# Altium schematic sheet 08 USB OTG & POWER.SchDoc
size A3; SPICEModelCacheUQTFMMXK: <root> / <DocumentId>UQTFMMXK</DocumentId> / </root>
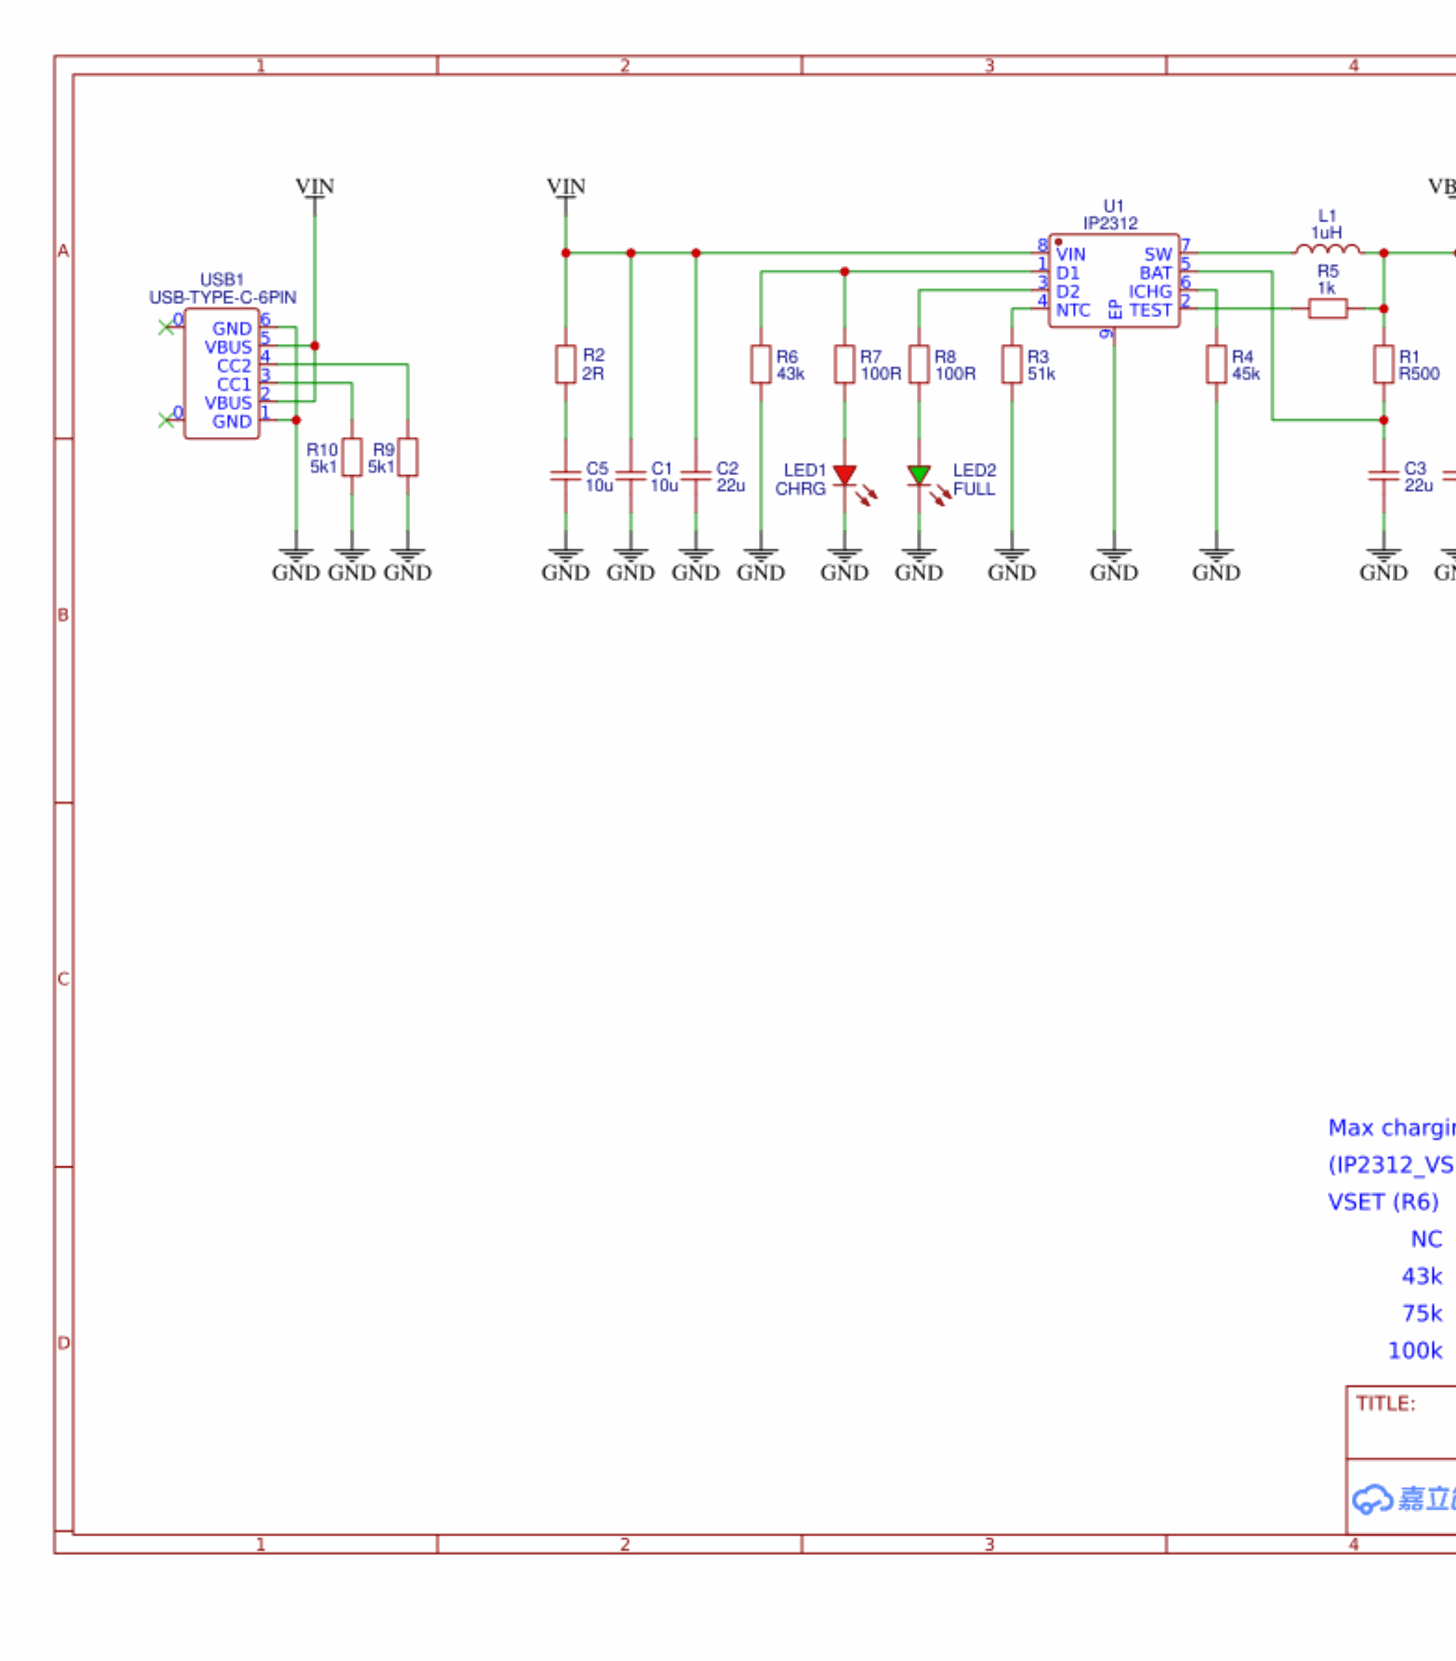
[diagram p0: 08 USB OTG & POWER.SchDoc, left]
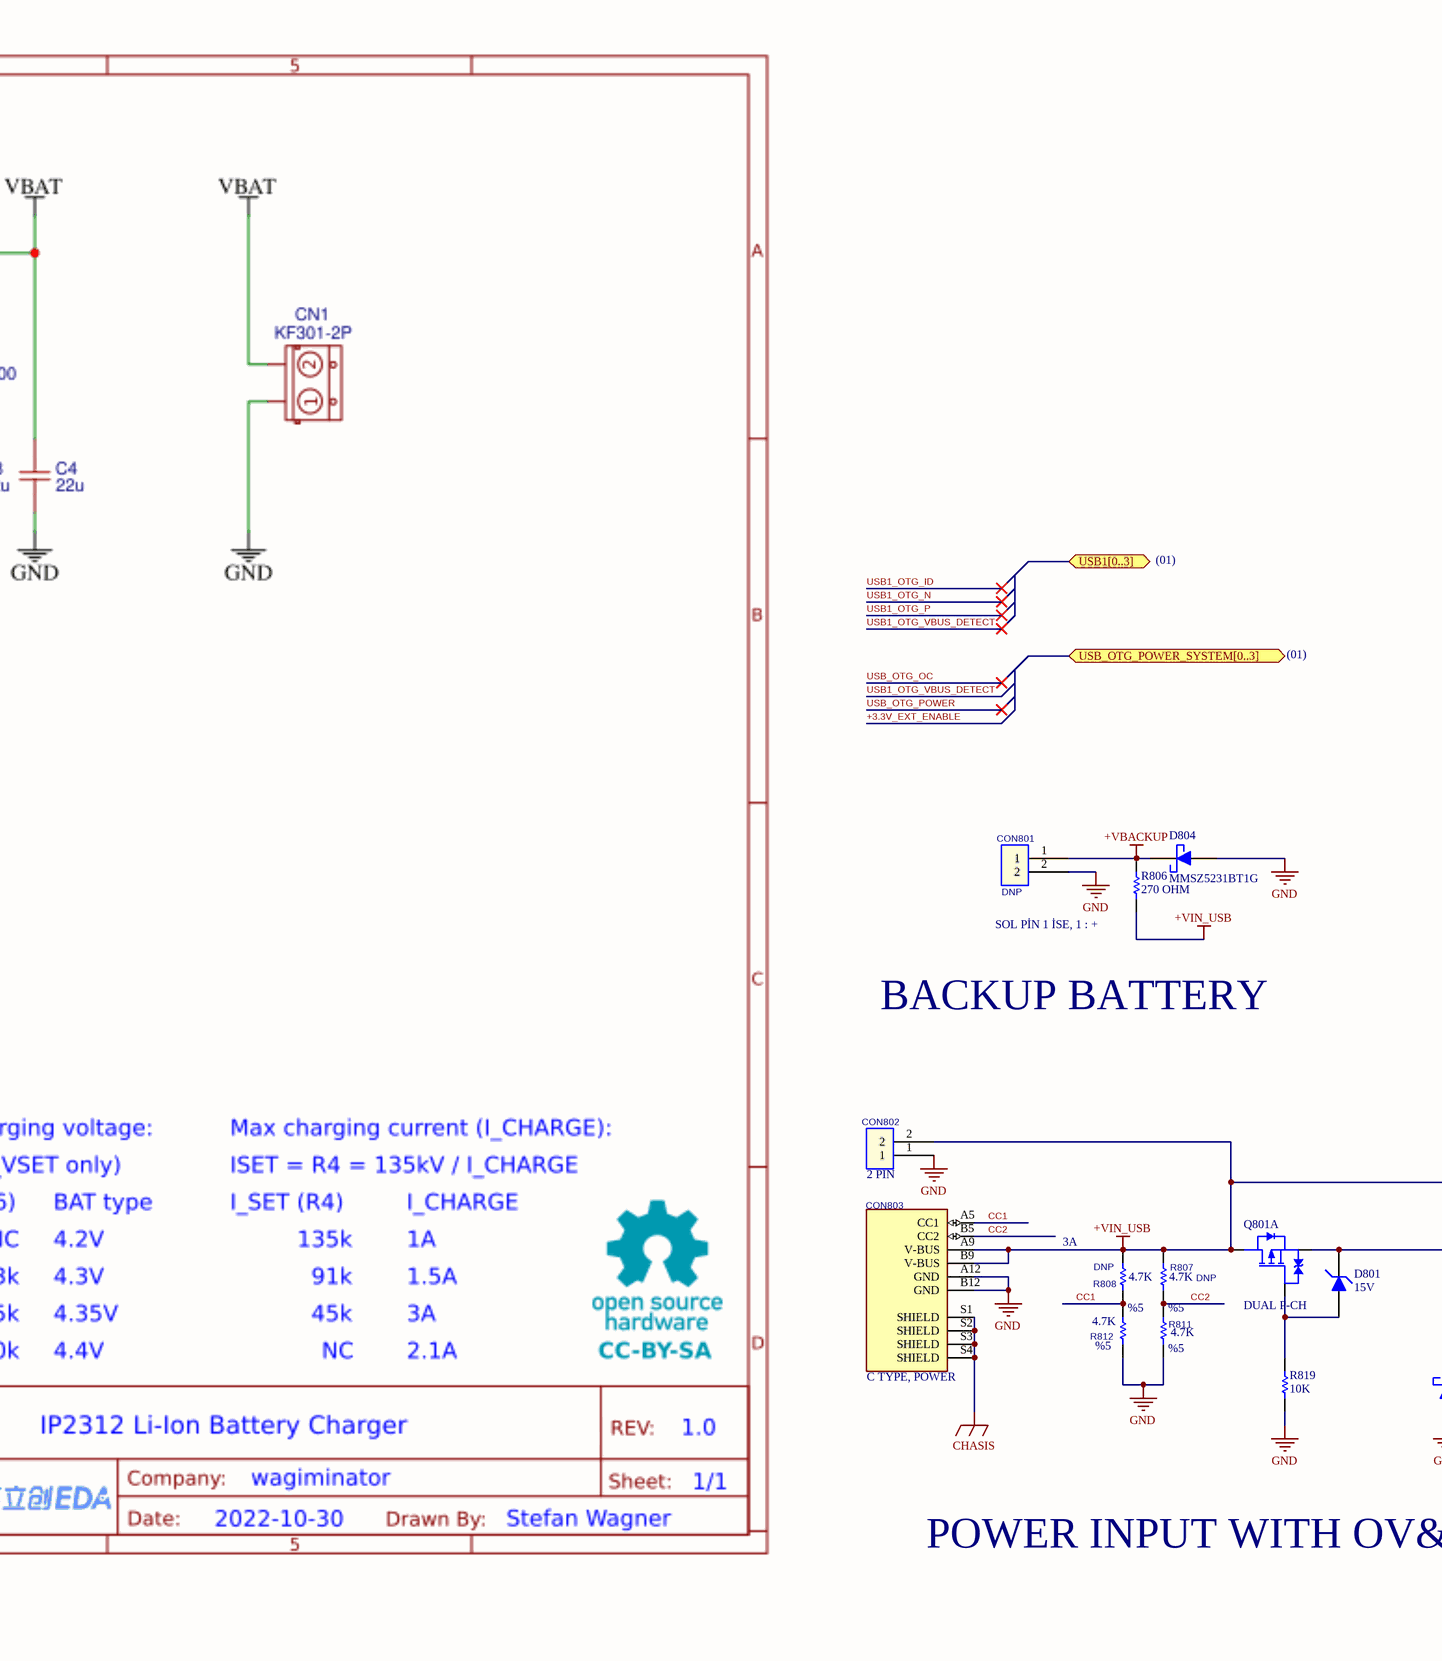
[diagram p1: 08 USB OTG & POWER.SchDoc, middle]
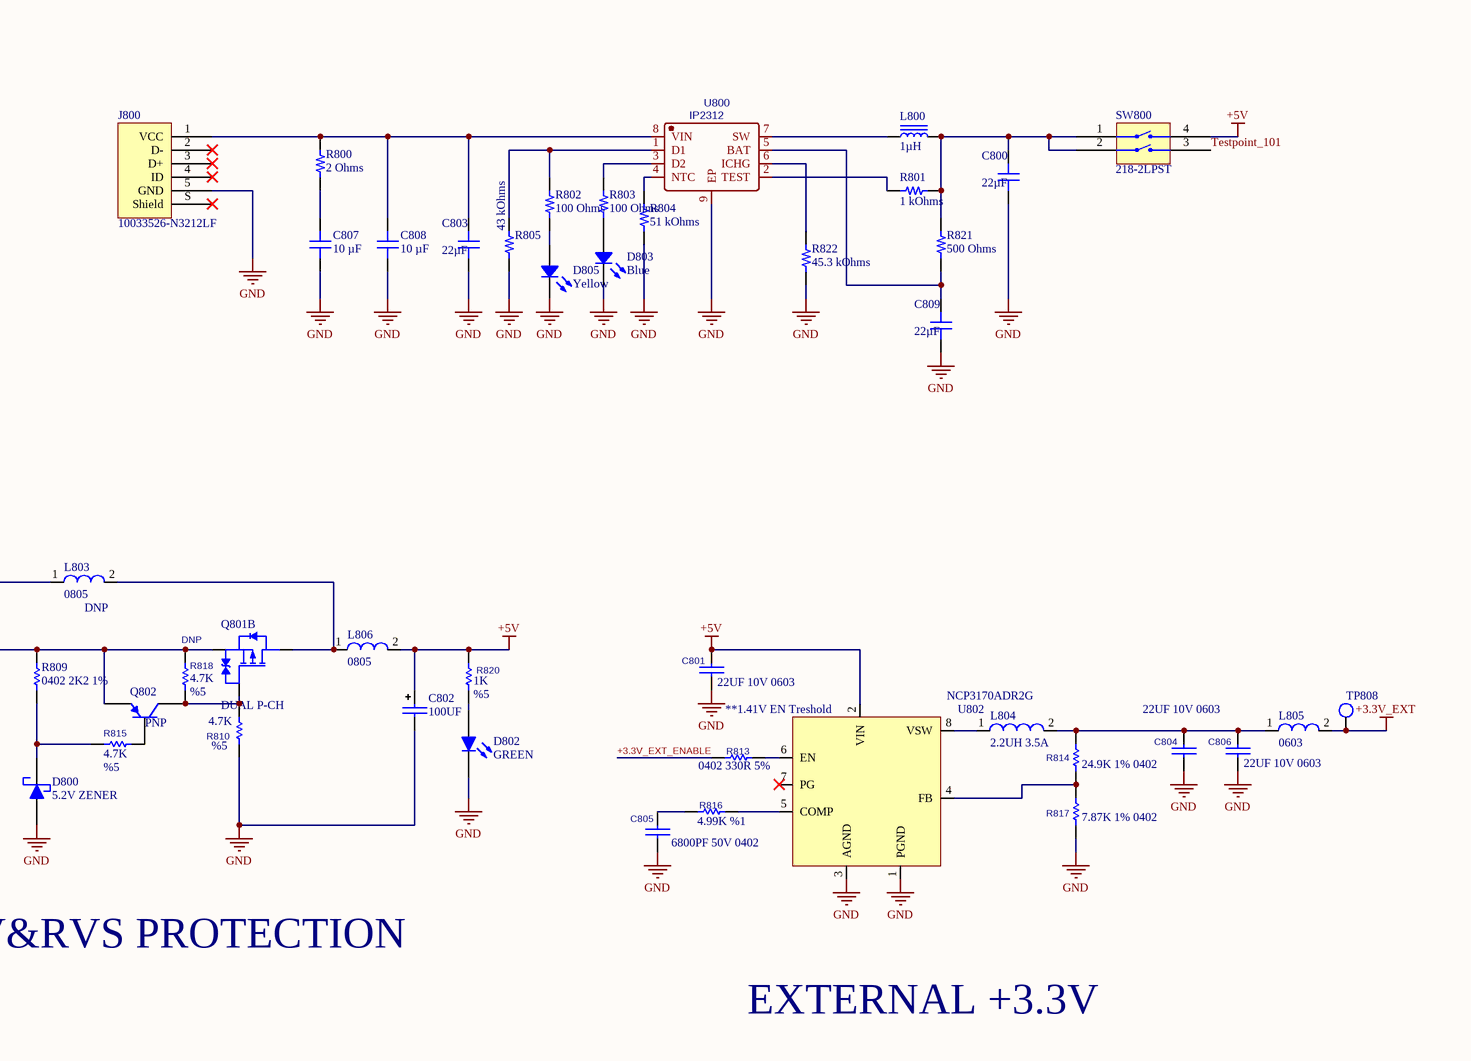
[diagram p2: 08 USB OTG & POWER.SchDoc, right]

## Parts
C800  22µF  [CAP 0603_1608]
C801  22UF 10V 0603  [0603_CC]
C802  100UF  [UWR1A101MCL1GB]
C803  22µF  [CAP 0603_1608]
C804  22UF 10V 0603  [0603_CC]
C805  6800PF 50V 0402  [0402_CC]
C806  22UF 10V 0603  [0603_CC]
C807  10 µF  [CAP 0603_1608]
C808  10 µF  [CAP 0603_1608]
C809  22µF  [CAP 0603_1608]
CON801  ASSY_OPT: DNP  [B2B-PH-K-S]  (hidden comment: CON-B2B-PH-K-S(LF)(SN))
CON802  2 PIN  [640456-2]
CON803  C TYPE, POWER  [CUI_UJC-HP-3-SMT-TR]
D800  5.2V ZENER  [SOD-323]
D801  15V  [SOD-323]
D802  GREEN  [0603_LED]
D803  Blue  [LED 0603_1608 BLUE]
D804  MMSZ5231BT1G  [SOD-123]  (no BOM)
D805  Yellow  [LED 0603_1608 YELLOW]
J800  10033526-N3212LF  [FCI USB 10033526-N3212LF]
L800  1µH  [IND 0603_1608 RF WW]
L803  0805  ASSY_OPT: DNP  [0805]  (no BOM)
L804  2.2UH 3.5A  [IND-NRS5030T2R2NMGJ]
L805  0603  [0603_RES]
L806  0805  [0805]
Q801  DUAL P-CH  [SO-8 - DUAL MOS - NAMED]  (parts A,B of 2)
Q802  PNP  [SOT23]
R800  2 Ohms  [RES 0603_1608]
R801  1 kOhms  [RES 0603_1608]
R802  100 Ohms  [RES 0603_1608]
R803  100 Ohms  [RES 0603_1608]
R804  51 kOhms  [RES 0603_1608]
R805  43 kOhms  [RES 0603_1608]
R806  270 OHM  [0603_RES]  (no BOM)
R807  4.7K  ASSY_OPT: DNP  Tolerance: %5  [0402_RES]
R808  4.7K  ASSY_OPT: DNP  Tolerance: %5  [0402_RES]
R809  0402 2K2 1%  [0402_RES]
R810  4.7K  Tolerance: %5  [0402_RES]
R811  4.7K  Tolerance: %5  [0402_RES]
R812  4.7K  Tolerance: %5  [0402_RES]
R813  0402 330R 5%  [0402_RES]
R814  24.9K 1% 0402  [0402_RES]
R815  4.7K  Tolerance: %5  [0402_RES]
R816  4.99K %1  [0603_RES]
R817  7.87K 1% 0402  [0402_RES]
R818  4.7K  ASSY_OPT: DNP  Tolerance: %5  [0402_RES]  (no BOM)
R819  10K  [0805]
R820  1K  Tolerance: %5  [0402_RES]
R821  500 Ohms  [RES 0603_1608]
R822  45.3 kOhms  [RES 0603_1608]
SW800  218-2LPST  [CTS 218-2LPJ]
TP808  TEST POINT 35  [testpoint_35mil]  (value not drawn)  (no BOM)
U800  IP2312  [SOP-8_EP_150MIL]
U802  NCP3170ADR2G  [IC-NCP3170ADR2G]

## Ports
USB1[0..3] (bidir), USB_OTG_POWER_SYSTEM[0..3] (bidir)

## Nets
+3.3V_EXT: L805.2 TP808.1
+5V: C801.1 C802.1 L806.2 R820.1 SW800.4(GND) U802.2(VIN)
+VBACKUP: CON801.1 D804.K R806.1
+VIN_USB: CON802.2 CON803.A9(V-BUS) CON803.B9(V-BUS) L803.1 Q801.D1 R806.2 R807.1 R808.1
CHASIS: CON803.S1(SHIELD) CON803.S2(SHIELD) CON803.S3(SHIELD) CON803.S4(SHIELD)
GND: C800.1 C801.2 C802.2 C803.1 C804.2 C805.2 C806.2 C807.1 C808.1 C809.1 CON801.2 CON802.1 CON803.A12(GND) CON803.B12(GND) D800.A D802.2(K) D803.2 D804.A D805.2 J800.5(GND) R804.1 R805.1 R810.2 R811.2 R812.2 R817.1 R819.1 R822.1 U800.9(EP) U802.1(PGND) U802.3(AGND)
+3.3V_EXT_ENABLE: R813.1
CC1: CON803.A5(CC1) R808.2 R812.1
CC2: CON803.B5(CC2) R807.2 R811.1
Testpoint_101: SW800.3(GND)
NetC800_2: C800.2 L800.2 R801.2 R821.2 SW800.1(GND) SW800.2(GND)
NetC803_2: C803.2 C808.2 J800.1(VCC) R800.2 U800.8(VIN)
NetC804_1: C804.1 C806.1 L804.2 L805.1 R814.2
NetC805_1: C805.1 R816.1
NetC807_2: C807.2 R800.1
NetC809_2: C809.2 R821.1 U800.5(BAT)
NetD800_K: D800.K R809.1 R815.1
NetD801_A: D801.A Q801.G1 R819.2
NetD801_K: D801.K Q801.S1 Q801.S2 Q802.2(E) R809.2 R818.2
NetD802_1: D802.1(A) R820.2
NetD803_1: D803.1 R803.1
NetD805_1: D805.1 R802.1
NetL800_1: L800.1 U800.7(SW)
NetL803_2: L803.2 L806.1 Q801.D2
NetL804_1: L804.1 U802.8(VSW)
NetQ801_G2: Q801.G2 Q802.3(C) R810.1 R818.1
NetQ802_1: Q802.1(B) R815.2
NetR801_1: R801.1 U800.2(TEST)
NetR802_2: R802.2 R805.2 U800.1(D1)
NetR803_2: R803.2 U800.3(D2)
NetR804_2: R804.2 U800.4(NTC)
NetR813_2: R813.2 U802.6(EN)
NetR814_1: R814.1 R817.2 U802.4(FB)
NetR816_2: R816.2 U802.5(COMP)
NetR822_2: R822.2 U800.6(ICHG)

Not connected (* = marked no-connect by the designer): J800 2(D-)* 3(D+)* 4(ID)* S(Shield)*; U802 7(PG)*

## Notes on the sheet
- (01)
- (near R806) SOL PİN 1 İSE, 1 : +
- BACKUP BATTERY
- (near R808) 3A
- (near U802) **1.41V EN Treshold
- POWER INPUT WITH OV&RVS PROTECTION
- EXTERNAL +3.3V
- Sheet Title:
- Inventron
- Size:
- Drawn By:
- Revision:
- Project:
- Checked By:
- A4
- Sheet
- of
- Budotek Teknopark
- Dudullu OSB
- Des 2. Cadde No:8/30
- Umraniye / ISTANBUL
- Electronics and Software
- Date:
- Time:
- ©2020 Inventron Electronics and Software. All rights reserved.

## Library data of the parts
C800 C803 C809 = 06036D226MAT2A: CAP CER 22UF 6.3V X5R 0603; manufacturer: AVX Corporation; Tolerance: ±20%; Part Number: 06036D226MAT2A; Value: 22µF; Applications: General Purpose; Capacitance: 22µF; componentlink1description: Datasheet; componentlink1url: http://datasheets.avx.com/cx5r.pdf; componentlink2description: DigiKey Link; componentlink2url: http://digikey.com/product-detail/en/avx-corporation/06036D226MAT2A/478-10812-1-ND/7536349; Device Package: 0603 (1608 Metric); lastupdated: 9/2/2020 1:03:16 AM; Lifecycle Status: Active; Minimum Order: 1; Mounting Type: Surface Mount, MLCC; Operating Temperature: -55°C ~ 85°C; Package / Case: 0603 (1608 Metric); packaging: TapeAndReel; partid: 13180; Part Status: Active; price: 0.10; series: -; Size / Dimension: 0.063" L x 0.032" W (1.60mm x 0.81mm); Supplier 1: DigiKey; Supplier Part Number 1: 478-10812-1-ND; Temperature Coefficient: X5R; Thickness (Max): 0.040" (1.02mm); Voltage - Rated: 6.3V
C801 C804 C806 = CAP-C1608X5R1A226M080AC: ±20% 10V Ceramic Capacitor X5R 0603 (1608 Metric); Manufacturer-1: Murata Electronics; Manufacturer Part Number-1: C1608X5R1A226M080AC; Footprint: 0603; Manufacturer-2: *; Manufacturer Part Number-2: *; Inventron Stock No: *; Created By: E.E; Created Date: 2.11.2020; Checked By: *; ASSY_OPT: *; Dimensions: *; Unit Price: *; Revision Date/Note: *; Price Break: *; Opt. Temp.: *; Class: Capacitor; Features: *
C802 = CAP-UWR1A101MCL1GB: CAP ALUM 100UF 20% 10V SMD; Manufacturer-1: Nichicon; Class: Capacitor; Manufacturer Part Number-1: UWR1A101MCL1GB; Footprint: *; Manufacturer-2: *; Manufacturer Part Number-2: *; Inventron Stock No: *; Created By: EE; Created Date: *; Checked By: *; ASSY_OPT: *; Dimensions: *; Unit Price: 0.05481; Revision Date/Note: *; Price Break: 1000; Opt. Temp.: *; Features: *
C805 = CAP-CL05B682KB5NNNC: 6800pF ±10% 50V Ceramic Capacitor X7R 0402 (1005 Metric); Manufacturer-1: Samsung Electro-Mechanics; Manufacturer Part Number-1: CL05B682KB5NNNC; Footprint: 0402; Manufacturer-2: *; Manufacturer Part Number-2: *; Inventron Stock No: *; Created By: E.E; Created Date: 15.11.2020; Checked By: *; ASSY_OPT: *; Dimensions: *; Unit Price: *; Revision Date/Note: *; Price Break: *; Opt. Temp.: *; Class: Capacitor; Features: *
C807 C808 = GRM188R60G106ME47D: CAP CER 10UF 4V X5R 0603; manufacturer: Murata Electronics; Tolerance: ±20%; Part Number: GRM188R60G106ME47D; Value: 10 µF; Applications: General Purpose; Capacitance: 10 µF; componentlink1description: Datasheet; componentlink1url: https://www.murata.com/~/media/webrenewal/support/library/catalog/products/capacitor/mlcc/c02e.ashx?la=en-us; componentlink2description: DigiKey Link; componentlink2url: https://www.digikey.com/en/products/detail/murata-electronics/GRM188R60G106ME47D/702562; Device Package: 0603 (1608 Metric); lastupdated: 2/9/2024 8:10:30 PM; Lifecycle Status: Active; Minimum Order: 1; Mounting Type: Surface Mount, MLCC; Operating Temperature: -55°C ~ 85°C; Package / Case: 0603 (1608 Metric); packaging: TapeAndReel; partid: 2393; Part Status: Active; price: 0.01; series: GRM; Size / Dimension: 0.063" L x 0.031" W (1.60mm x 0.80mm); Supplier 1: DigiKey; Supplier Part Number 1: 490-3298-1-ND; Temperature Coefficient: X5R; Thickness (Max): 0.035" (0.90mm); Voltage - Rated: 4V
CON801 = CON-B2B-PH-K-S(LF)(SN): CONN HEADER VERT 2POS 2MM; Manufacturer-1: JST; Class: Connector; Manufacturer Part Number-1: B2B-PH-K-S(LF)(SN); Footprint: *; Manufacturer-2: *; Manufacturer Part Number-2: *; Inventron Stock No: *; Created By: LA; Created Date: 16.05.2019; Checked By: *; Dimensions: *; Unit Price: 0,072; Revision Date/Note: *; Price Break: 1K; Opt. Temp.: *
CON802 = CON-640456-2: CONN HEADER VERT 2POS 2.54MM; Manufacturer-1: TE; Class: Connector; Manufacturer Part Number-1: 640456-2; Footprint: *; Manufacturer-2: *; Manufacturer Part Number-2: *; Inventron Stock No: *; Created By: LA; Created Date: 16.05.2019; Checked By: *; ASSY_OPT: *; Dimensions: *; Unit Price: 0,048; Revision Date/Note: *; Price Break: 1K; Opt. Temp.: *
CON803 = 0-CON-UJC-HP-3-SMT-TR: USB JACK, C TYPE, POWER ONLY, 6; Manufacturer-1: CUI Devices; Opt. Temp.: -40°C ~ 80°C; Class: Connector; Manufacturer Part Number-1: UJC-HP-3-SMT-TR; Footprint: C TYPE, POWER ONLY, 6; Manufacturer-2: *; Manufacturer Part Number-2: *; Inventron Stock No: *; Created By: E.E; Created Date: 30.10.2020; Checked By: *; ASSY_OPT: *; Dimensions: *; Unit Price: 0.360; Revision Date/Note: *; Price Break: *; Features: *
D800 = DIODE-PZU5.1B2A,115: DIODE ZENER 5.1V 320MW SOD323; Manufacturer-1: Nexperia USA Inc.; Manufacturer Part Number-1: PZU5.1B2A,115; Manufacturer-2: *; Manufacturer Part Number-2: *; Inventron Stock No: *; Created By: EE; Checked By: *; ASSY_OPT: *; Dimensions: *; Revision Date/Note: *; Class: Diode
D801 = DIODE-PDZ15B,115: DIODE ZENER 15V 400MW SOD323; Manufacturer-1: Nexperia USA Inc.; Manufacturer Part Number-1: PDZ15B,115; Footprint: *; Manufacturer-2: *; Manufacturer Part Number-2: *; Inventron Stock No: *; Created By: LA; Created Date: *; Checked By: *; ASSY_OPT: *; Dimensions: *; Revision Date/Note: *; Opt. Temp.: *; Class: Diode
D802 = LED-LTST-C190KRKT: LED SMD 0603 SUPER GREEN; Manufacturer-1: LITEON; Manufacturer Part Number-1: LTST-C190KRKT; Footprint: *; Manufacturer-2: *; Manufacturer Part Number-2: *; Inventron Stock No: *; Created By: *; Created Date: *; Checked By: *; ASSY_OPT: *; Dimensions: *; Unit Price: 0.03343; Revision Date/Note: *; Price Break: 4000; Opt. Temp.: *; Class: Led; Features: *
D803 = LB Q39E-N1OO-35-1: LED BLUE DIFFUSED 0603 SMD; Manufacturer: OSRAM Opto Semiconductors Inc.; Configuration: Standard; Current - Test: 5mA; Lens Color: White; Lens Size: 1.10mm x 0.80mm; Lens Style: Rectangle with Flat Top; Millicandela Rating: 42mcd; Viewing Angle: 170°, 130°; Voltage - Forward (Vf) (Typ): 2.85V; Wavelength - Dominant: 470nm; Wavelength - Peak: 465nm; Part Number: LB Q39E-N1OO-35-1; Color: Blue; ComponentLink1Description: Datasheet; ComponentLink1URL: https://dammedia.osram.info/media/resource/hires/osram-dam-2494408/LB%20Q39E.pdf; ComponentLink2Description: DigiKey Link; ComponentLink2URL: https://www.digikey.com/en/products/detail/osram-opto-semiconductors-inc/LB-Q39E-N1OO-35-1/2176321; Device Package: 0603 (1608 Metric); Height (Max): 0.40mm; LastUpdated: 3/11/2024 7:50:10 AM; Lens Transparency: Diffused; Lifecycle Status: Active; Minimum Order: 1; Mounting Type: Surface Mount; Package / Case: 0603 (1608 Metric); Packaging: TapeAndReel; PartId: 840; Part Status: Active; Price: 0.07; Series: CHIPLED 0603; Size / Dimension: 1.60mm L x 0.80mm W; Supplier 1: DigiKey; Supplier Part Number 1: 475-2815-1-ND; Supplier Device Package: 0603; Value: Blue
D804 = DIODE-MMSZ5231BT1G: DIODE ZENER 5.1V 500MW SOD123; Manufacturer-1: ON Semiconductor; ASSY_OPT: DNP; Manufacturer Part Number-1: MMSZ5231BT1G; Manufacturer-2: *; Manufacturer Part Number-2: *; Inventron Stock No: *; Created By: EE; Checked By: *; Dimensions: *; Revision Date/Note: *; Class: Diode
D805 = SML-D15YWT86C: LED YELLOW 1608 SMD; Manufacturer: Rohm Semiconductor; Configuration: Standard; Current - Test: 20mA; Lens Color: White; Lens Size: 1.20mm x 0.80mm; Lens Style: Rectangle with Flat Top; Millicandela Rating: 224mcd; Voltage - Forward (Vf) (Typ): 2.1V; Wavelength - Dominant: 590nm; Part Number: SML-D15YWT86C; Color: Yellow; ComponentLink1Description: Datasheet; ComponentLink1URL: https://www.rohm.com/datasheet/SML-D15YW(C)/sml-d15(c)-e; ComponentLink2Description: DigiKey Link; ComponentLink2URL: https://www.digikey.com/en/products/detail/rohm-semiconductor/SML-D15YWT86C/9090442; Device Package: 0603 (1608 Metric); Height (Max): 0.65mm; LastUpdated: 3/11/2024 7:53:26 AM; Lifecycle Status: Active; Minimum Order: 1; Mounting Type: Surface Mount; Package / Case: 0603 (1608 Metric); Packaging: TapeAndReel; PartId: 86; Part Status: Active; Price: 0.08; Series: SML-D15; Size / Dimension: 1.60mm L x 0.80mm W; Supplier 1: DigiKey; Supplier Part Number 1: SML-D15YWT86CCT-ND; Supplier Device Package: 1608 (0603); Value: Yellow
J800 = 10033526-N3212LF: CONN RCPT MINI USB B 5POS SMD RA; Manufacturer: Amphenol ICC (FCI); Connector Type: USB - mini B; Current Rating (Amps): 1A per Contact; Gender: Receptacle; Mating Cycles: 5000; Number of Contacts: 5; Number of Ports: 1; Shielding: Shielded; Voltage - Rated: 30V; Part Number: 10033526-N3212LF; ComponentLink1Description: Datasheet; ComponentLink1URL: http://www.amphenol-icc.com/media/wysiwyg/files/drawing/10033526.pdf; ComponentLink2Description: DigiKey Link; ComponentLink2URL: //digikey.com/product-detail/en/amphenol-icc-fci/10033526-N3212LF/609-4700-2-ND/4292074; Features: Board Guide, Solder Retention; LastUpdated: 12/9/2019 8:52:14 PM; Lifecycle Status: 0; Minimum Order: 1; Mounting Feature: Horizontal; Mounting Type: Surface Mount, Right Angle; Operating Temperature: -25°C ~ 85°C; Packaging: TapeAndReel; Part Status: Active; Price: 0.39; Series: -; Supplier 1: DigiKey; Supplier Part Number 1: 609-4700-2-ND; Termination: Solder
L800 = AISC-0603F-1R0J-T: FIXED IND 1UH 280MA 940 MOHM SMD; Manufacturer: Abracon LLC; DC Resistance (DCR): 940mOhm Max; Frequency - Self Resonant: 410MHz; Inductance Frequency - Test: 7.9MHz; Material - Core: Ferrite; Shielding: Unshielded; Tolerance: ±5%; Type: Wirewound; Part Number: AISC-0603F-1R0J-T; ComponentLink1Description: Datasheet; ComponentLink1URL: https://abracon.com/Magnetics/inductors/AISC-0603F.pdf; ComponentLink2Description: DigiKey Link; ComponentLink2URL: http://digikey.com/product-detail/en/abracon-llc/AISC-0603F-1R0J-T/535-12526-1-ND/4864669; Current Rating (Amps): 280mA; Device Package: 0603 (1608 Metric); Height - Seated (Max): 0.047" (1.20mm); Inductance: 1µH; LastUpdated: 9/6/2020 11:05:18 AM; Lifecycle Status: Active; Minimum Order: 1; Mounting Type: Surface Mount; Operating Temperature: -40°C ~ 85°C; Package / Case: 0603 (1608 Metric); Packaging: TapeAndReel; PartId: 1107; Part Status: Active; Price: 0.16; Series: AISC-0603F; Size / Dimension: 0.063" L x 0.039" W (1.60mm x 1.00mm); Supplier 1: DigiKey; Supplier Part Number 1: 535-12526-1-ND; Supplier Device Package: 0603 (1608 Metric); Value: 1µH
L803 L806 = IND-FERRITE (RES 0 OHM) 0805: 0OHM 0805; Manufacturer Part Number-1: AC0805JR-070RL; Manufacturer-1: YAGEO; Class: Inductor; Manufacturer-2: *; Inventron Stock No: *; Created By: EE; Checked By: *; Dimensions: *; Revision Date/Note: *
  L806: ASSY_OPT: *
L804 = IND-NRS5030T2R2NMGJ: Shielded Wirewound Inductor 23mOhm Nonstandard; Manufacturer-1: Taiyo Yuden; Manufacturer Part Number-1: NRS5030T2R2NMGJ; Footprint: *; Manufacturer-2: *; Manufacturer Part Number-2: *; Inventron Stock No: *; Created By: E.E; Created Date: 3.11.2020; Checked By: *; ASSY_OPT: *; Dimensions: *; Unit Price: *; Revision Date/Note: *; Price Break: *; Opt. Temp.: *; Class: Inductor; Features: *
L805 = IND-FERRITE (RES 0 OHM) 0603: 0OHM 0603; Manufacturer Part Number-1: RC0603JR-070RL; Manufacturer-1: YAGEO; Class: Inductor; Footprint: 0603; Manufacturer-2: *; Inventron Stock No: *; Created By: EE; Checked By: *; ASSY_OPT: *; Dimensions: *; Revision Date/Note: *
Q801 = MOS-P-DMP3028LSD-13: MOSFET 2P-CH 30V 6A SO-8; Manufacturer-1: Diodes Incorporated; Class: Transistor; Manufacturer Part Number-1: DMP3028LSD-13; Footprint: SO-8; Manufacturer-2: *; Manufacturer Part Number-2: *; Inventron Stock No: *; Created By: *; Created Date: *; Checked By: *; ASSY_OPT: *; Dimensions: *; Unit Price: *; Revision Date/Note: *; Price Break: *; Opt. Temp.: *; Features: *
Q802 = TRANSISTOR-BC856: TRANS PNP 65V 0.1A SOT-23; Manufacturer Part Number-1: BC856; Manufacturer-1: ON Semi; Footprint: *; Manufacturer-2: *; Manufacturer Part Number-2: *; Inventron Stock No: *; Created By: LA; Created Date: *; Checked By: *; ASSY_OPT: *; Dimensions: *; Unit Price: *; Revision Date/Note: *; Price Break: *; Opt. Temp.: *; Class: TRANSISTOR
R800 = RK73B1JTTD2R0J: RES 2 OHM 5% 1/8W 0603; Manufacturer: KOA Speer Electronics, Inc.; Power (Watts): 0.125W, 1/8W; Temperature Coefficient: ±200ppm/°C; Part Number: RK73B1JTTD2R0J; Value: 2 Ohms; ComponentLink1Description: Datasheet; ComponentLink1URL: http://www.koaspeer.com/catimages/Products/RK73B/RK73B.pdf; ComponentLink2Description: DigiKey Link; ComponentLink2URL: https://www.digikey.com/en/products/detail/koa-speer-electronics-inc/RK73B1JTTD2R0J/9844787; Composition: Thick Film; Device Package: 0603 (1608 Metric); Features: Automotive AEC-Q200; Height - Seated (Max): 0.022" (0.55mm); LastUpdated: 2/9/2024 8:43:32 PM; Lifecycle Status: Active; Minimum Order: 1; Number of Terminations: 2; Operating Temperature: -55°C ~ 155°C; Package / Case: 0603 (1608 Metric); Packaging: CutTape; PartId: 6052; Part Status: Active; Price: 0.01; Ratings: AEC-Q200; Resistance: 2 Ohms; Series: RK73B; Size / Dimension: 0.063" L x 0.031" W (1.60mm x 0.80mm); Supplier 1: DigiKey; Supplier Part Number 1: 2019-RK73B1JTTD2R0JCT-ND; Supplier Device Package: 0603; Tolerance: ±5%
R801 = CPF0603B1K0E: RES SMD 1K OHM 0.1% 1/16W 0603; Manufacturer: TE Connectivity Passive Product; Power (Watts): 0.063W, 1/16W; Temperature Coefficient: ±25ppm/°C; Part Number: CPF0603B1K0E; Value: 1 kOhms; ComponentLink1Description: Datasheet; ComponentLink1URL: https://www.te.com/commerce/DocumentDelivery/DDEController?Action=srchrtrv&DocNm=1773200&DocType=DS&DocLang=English; ComponentLink2Description: DigiKey Link; ComponentLink2URL: https://www.digikey.com/en/products/detail/te-connectivity-passive-product/CPF0603B1K0E/2390473; Composition: Thin Film; Device Package: 0603 (1608 Metric); Height - Seated (Max): 0.022" (0.55mm); LastUpdated: 2/9/2024 8:43:37 PM; Lifecycle Status: Active; Minimum Order: 1; Number of Terminations: 2; Operating Temperature: -55°C ~ 155°C; Package / Case: 0603 (1608 Metric); Packaging: TapeAndReel; PartId: 4877; Part Status: Active; Price: 0.09; Resistance: 1 kOhms; Series: CPF, Neohm; Size / Dimension: 0.061" L x 0.031" W (1.55mm x 0.80mm); Supplier 1: DigiKey; Supplier Part Number 1: A119887CT-ND; Supplier Device Package: 0603; Tolerance: ±0.1%
R802 R803 = RNCS0603BKE100R: RES 100 OHM 0.1% 1/16W 0603; Manufacturer: Stackpole Electronics Inc; Power (Watts): 0.063W, 1/16W; Temperature Coefficient: ±25ppm/°C; Part Number: RNCS0603BKE100R; Value: 100 Ohms; ComponentLink1Description: Datasheet; ComponentLink1URL: https://www.seielect.com/catalog/sei-rncs_rnch.pdf; ComponentLink2Description: DigiKey Link; ComponentLink2URL: https://www.digikey.com/en/products/detail/stackpole-electronics-inc/RNCS0603BKE100R/1799988; Composition: Thin Film; Device Package: 0603 (1608 Metric); Features: Anti-Corrosive, Automotive AEC-Q200, Moisture Resistant; Height - Seated (Max): 0.022" (0.55mm); LastUpdated: 2/9/2024 8:43:37 PM; Lifecycle Status: Active; Minimum Order: 1; Number of Terminations: 2; Operating Temperature: -55°C ~ 155°C; Package / Case: 0603 (1608 Metric); Packaging: TapeAndReel; PartId: 4839; Part Status: Active; Price: 0.06; Ratings: AEC-Q200; Resistance: 100 Ohms; Series: RNCS; Size / Dimension: 0.061" L x 0.031" W (1.55mm x 0.80mm); Supplier 1: DigiKey; Supplier Part Number 1: RNCS0603BKE100RCT-ND; Supplier Device Package: 0603; Tolerance: ±0.1%
R804 = RMCF0603JT51K0: RES 51K OHM 5% 1/10W 0603; Manufacturer: Stackpole Electronics Inc; Power (Watts): 0.1W, 1/10W; Temperature Coefficient: ±200ppm/°C; Part Number: RMCF0603JT51K0; Value: 51 kOhms; ComponentLink1Description: Datasheet; ComponentLink1URL: https://www.seielect.com/catalog/sei-rmcf_rmcp.pdf; ComponentLink2Description: DigiKey Link; ComponentLink2URL: https://www.digikey.com/en/products/detail/stackpole-electronics-inc/RMCF0603JT51K0/1757995; Composition: Thick Film; Device Package: 0603 (1608 Metric); Features: Automotive AEC-Q200; Height - Seated (Max): 0.022" (0.55mm); LastUpdated: 2/9/2024 8:43:32 PM; Lifecycle Status: Active; Minimum Order: 1; Number of Terminations: 2; Operating Temperature: -55°C ~ 155°C; Package / Case: 0603 (1608 Metric); Packaging: CutTape; PartId: 5951; Part Status: Active; Price: 0.01; Ratings: AEC-Q200; Resistance: 51 kOhms; Series: RMCF; Size / Dimension: 0.061" L x 0.031" W (1.55mm x 0.80mm); Supplier 1: DigiKey; Supplier Part Number 1: RMCF0603JT51K0CT-ND; Supplier Device Package: 0603; Tolerance: ±5%
R805 = RG1608P-433-B-T5: RES SMD 43K OHM 0.1% 1/10W 0603; Manufacturer: Susumu; Power (Watts): 0.1W, 1/10W; Temperature Coefficient: ±25ppm/°C; Part Number: RG1608P-433-B-T5; Value: 43 kOhms; ComponentLink1Description: Datasheet; ComponentLink1URL: //media.digikey.com/pdf/Data%20Sheets/Susumu%20PDFs/RG_RM_RGH_Oct2012.pdf; ComponentLink2Description: DigiKey Link; ComponentLink2URL: https://www.digikey.com/en/products/detail/susumu/RG1608P-433-B-T5/1240589; Composition: Thin Film; Device Package: 0603 (1608 Metric); Features: Anti-Sulfur, Automotive AEC-Q200; Height - Seated (Max): 0.020" (0.50mm); LastUpdated: 2/9/2024 8:43:27 PM; Lifecycle Status: Active; Minimum Order: 1; Number of Terminations: 2; Operating Temperature: -55°C ~ 155°C; Package / Case: 0603 (1608 Metric); Packaging: TapeAndReel; PartId: 7406; Part Status: Active; Price: 0.05; Ratings: AEC-Q200; Resistance: 43 kOhms; Series: RG; Size / Dimension: 0.063" L x 0.031" W (1.60mm x 0.80mm); Supplier 1: DigiKey; Supplier Part Number 1: RG16P43.0KBCT-ND; Supplier Device Package: 0603; Tolerance: ±0.1%
R806 = RES-RC0603JR-07270RL: RES SMD 270 OHM 5% 1/10W 0603; Manufacturer-1: Yageo; ASSY_OPT: DNP; Class: Resistor; Manufacturer Part Number-1: RC0603JR-07270RL; Footprint: 0603; Manufacturer-2: *; Manufacturer Part Number-2: *; Inventron Stock No: *; Created By: EE; Created Date: *; Checked By: *; Dimensions: *; Unit Price: *; Revision Date/Note: *; Price Break: *; Opt. Temp.: *; Tolerance: *
R807 R808 R810-R812 R815 R818 = RES-4.7K: RES 4.7K OHM 5% 1/16W 0402; Manufacturer Part Number-1: RC0402JR-074K7L; Manufacturer-1: Yageo; Opt. Temp.: -55/+155; Class: Resistor; Footprint: 0402; Manufacturer-2: *; Manufacturer Part Number-2: *; Inventron Stock No: *; Created By: LA; Checked By: *; Dimensions: *; Revision Date/Note: *
  R810-R812 R815: ASSY_OPT: *
R809 = RES-CRGCQ0402F2K2: 2.2 ±1% 0.063W, 1/16W Chip Resistor 0402 (1005 Metric) Automotive AEC-Q200, Moisture Resistant Thick Film; Manufacturer-1: TE Connectivity Passive Product; Opt. Temp.: -55°C ~ 155°C; Manufacturer Part Number-1: CRGCQ0402F2K2; Footprint: 0402; Manufacturer-2: *; Manufacturer Part Number-2: *; Inventron Stock No: *; Created By: E.E; Created Date: 22.10.2020; Checked By: *; ASSY_OPT: *; Dimensions: *; Unit Price: *; Revision Date/Note: *; Price Break: *; Class: Resistor; Tolerance: *
R813 = RES-CRGCQ0402J330R: 330 ±5% 0.063W, 1/16W Chip Resistor 0402 (1005 Metric) Automotive AEC-Q200, Moisture Resistant Thick Film; Manufacturer-1: TE Connectivity Passive Product; Opt. Temp.: -55°C ~ 155°C; Tolerance: %5; Manufacturer Part Number-1: CRGCQ0402J330R; Footprint: 0402; Manufacturer-2: *; Manufacturer Part Number-2: *; Inventron Stock No: *; Created By: E.E; Created Date: 23.10.2020; Checked By: *; ASSY_OPT: *; Dimensions: *; Unit Price: *; Revision Date/Note: *; Price Break: *; Class: Resistor
R814 = RES-RC0402FR-0724K9L: 24.9 ±1% 0.063W, 1/16W Chip Resistor 0402 (1005 Metric) - Thick Film; Manufacturer-1: Yageo; Opt. Temp.: -55°C ~ 155°C; Manufacturer Part Number-1: RC0402FR-0724K9L; Footprint: 0402; Manufacturer-2: *; Manufacturer Part Number-2: *; Inventron Stock No: *; Created By: E.E; Created Date: 19.10.2020; Checked By: *; ASSY_OPT: *; Dimensions: *; Unit Price: *; Revision Date/Note: *; Price Break: *; Class: Resistor; Tolerance: *
R816 = RES-RC0603FR-074K99L: RES 4.99K OHM %1 1/10W 0603; Manufacturer-1: YAGEO; Opt. Temp.: -55/+155; Class: Resistor; Manufacturer Part Number-1: RC0603FR-074K99L; Footprint: 0603; Manufacturer-2: *; Manufacturer Part Number-2: *; Inventron Stock No: *; Created By: LA; Created Date: *; Checked By: *; ASSY_OPT: *; Dimensions: *; Unit Price: *; Revision Date/Note: *; Price Break: *; Tolerance: *
R817 = RES-CRCW04027K87FKED: 7.87 kOhms ±1% 0.063W, 1/16W Chip Resistor 0402 (1005 Metric) Automotive AEC-Q200 Thick Film; Manufacturer-1: Vishay Dale; Manufacturer Part Number-1: CRCW04027K87FKED; Footprint: 0402; Manufacturer-2: *; Manufacturer Part Number-2: *; Inventron Stock No: *; Created By: EE; Created Date: *; Checked By: *; ASSY_OPT: *; Dimensions: *; Unit Price: *; Revision Date/Note: *; Price Break: *; Opt. Temp.: *; Class: Resistor; Tolerance: *
R819 = RES-0805S8J0103TDE: RES SMD 10K 5% 0805; Manufacturer-1: ROYALOHM; Class: Resistor; Manufacturer Part Number-1: 0805S8J0103TDE; Manufacturer-2: *; Manufacturer Part Number-2: *; Inventron Stock No: *; Created By: *; Created Date: *; Checked By: *; ASSY_OPT: *; Dimensions: *; Unit Price: *; Revision Date/Note: *; Price Break: *; Opt. Temp.: *; Tolerance: *
R820 = RES-RMCF0402JT1K00: RES 1K OHM 5% 1/16W 0402; Manufacturer-1: STACKPOLE; Opt. Temp.: -55/+155; Class: Resistor; Manufacturer Part Number-1: RMCF0402JT1K00; Footprint: 0402; Manufacturer-2: *; Manufacturer Part Number-2: *; Inventron Stock No: *; Created By: LA; Created Date: 23.11.2018; Checked By: *; ASSY_OPT: *; Dimensions: *; Unit Price: 0,00127; Revision Date/Note: *; Price Break: 10K
R821 = TNPU0603500RAZEN00: RES SMD 500 OHM 0.05% 1/10W 0603; Manufacturer: Vishay Dale; Power (Watts): 0.1W, 1/10W; Temperature Coefficient: ±5ppm/°C; Part Number: TNPU0603500RAZEN00; Value: 500 Ohms; ComponentLink1Description: Datasheet; ComponentLink1URL: http://www.vishay.com/docs/28779/tnpue3.pdf; ComponentLink2Description: DigiKey Link; ComponentLink2URL: https://www.digikey.com/en/products/detail/vishay-dale/TNPU0603500RAZEN00/6615936; Composition: Thin Film; Device Package: 0603 (1608 Metric); Features: Anti-Sulfur, Automotive AEC-Q200, Moisture Resistant; Height - Seated (Max): 0.022" (0.55mm); LastUpdated: 2/9/2024 8:43:09 PM; Lifecycle Status: Active; Minimum Order: 1; Number of Terminations: 2; Operating Temperature: -55°C ~ 125°C; Package / Case: 0603 (1608 Metric); Packaging: TapeAndReel; PartId: 11840; Part Status: Active; Price: 1.13; Ratings: AEC-Q200; Resistance: 500 Ohms; Series: TNPU e3; Size / Dimension: 0.063" L x 0.033" W (1.60mm x 0.85mm); Supplier 1: DigiKey; Supplier Part Number 1: 541-3301-1-ND; Supplier Device Package: 0603; Tolerance: ±0.05%
R822 = CPF0603F45K3C1: RES SMD 45.3K OHM 1% 1/16W 0603; Manufacturer: TE Connectivity Passive Product; Power (Watts): 0.063W, 1/16W; Temperature Coefficient: ±50ppm/°C; Part Number: CPF0603F45K3C1; Value: 45.3 kOhms; ComponentLink1Description: Datasheet; ComponentLink1URL: https://www.te.com/commerce/DocumentDelivery/DDEController?Action=srchrtrv&DocNm=1773200&DocType=DS&DocLang=English; ComponentLink2Description: DigiKey Link; ComponentLink2URL: https://www.digikey.com/en/products/detail/te-connectivity-passive-product/CPF0603F45K3C1/2384645; Composition: Thin Film; Device Package: 0603 (1608 Metric); Height - Seated (Max): 0.022" (0.55mm); LastUpdated: 2/9/2024 8:43:28 PM; Lifecycle Status: Active; Minimum Order: 1; Number of Terminations: 2; Operating Temperature: -55°C ~ 155°C; Package / Case: 0603 (1608 Metric); Packaging: TapeAndReel; PartId: 7068; Part Status: Active; Price: 0.02; Resistance: 45.3 kOhms; Series: CPF, Neohm; Size / Dimension: 0.061" L x 0.031" W (1.55mm x 0.80mm); Supplier 1: DigiKey; Supplier Part Number 1: A102276CT-ND; Supplier Device Package: 0603; Tolerance: ±1%
SW800 = 218-2LPST: SWITCH SLIDE DIP SPST 25MA 24V; Manufacturer: CTS Electrocomponents; Actuator Level: Flush, Recessed; Actuator Type: Slide (Standard); Number of Positions: 2; Pitch: 0.050" (1.27mm), Half; Voltage Rating: 24VDC; Washable: Yes; Part Number: 218-2LPST; Circuit: SPST; ComponentLink1Description: Datasheet; ComponentLink1URL: https://www.ctscorp.com/wp-content/uploads/218.pdf; ComponentLink2Description: DigiKey Link; ComponentLink2URL: http://digikey.com/product-detail/en/cts-electrocomponents/218-2LPST/CT2182LPST-ND/267319; Contact Finish: Gold; Contact Material: Beryllium Copper; Current Rating (Amps): 25mA; Features: Epoxy Sealed Terminals, Tape Seal; Height Above Board: 0.104" (2.65mm); LastUpdated: 1/4/2020 6:30:26 PM; Lifecycle Status: Active; Minimum Order: 1; Mounting Type: Surface Mount; Operating Temperature: -55°C ~ 85°C; Packaging: Tube; PartId: 3; Part Status: Active; Price: 1.04; Series: 218; Supplier 1: DigiKey; Supplier Part Number 1: CT2182LPST-ND; Termination Style: Gull Wing
U800 = IP2312: Manufacturer: INJOINIC(英集芯); Manufacturer Part: IP2312U_VSET; Contributor: Stefan Wagner; Supplier: LCSC; Supplier Part: C605432; JLCPCB Part Class: Extended Part; spicePre: U; spiceSymbolName: IP2312-4V35
U802 = IC-NCP3170ADR2G: Buck Regulator, Switching, PWM, 3.0 A; Manufacturer-1: ON Semiconductor; Opt. Temp.: -40 to +85; Class: ICs; Manufacturer Part Number-1: NCP3170ADR2G; Footprint: SOIC-8; Manufacturer-2: *; Manufacturer Part Number-2: *; Inventron Stock No: *; Created By: E.E; Created Date: 16.10.2020; Checked By: *; ASSY_OPT: *; Dimensions: *; Unit Price: 0.25; Revision Date/Note: *; Price Break: 5000